# Altium schematic sheet toplevel.SchDoc
size A4
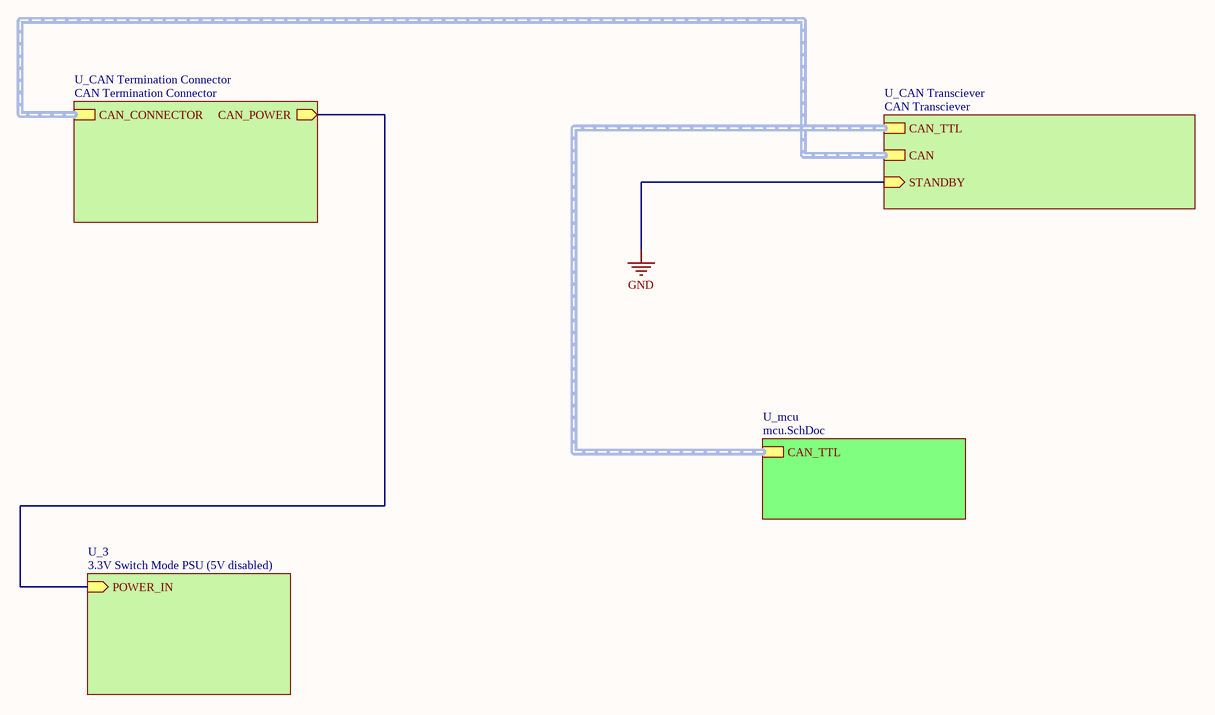
[diagram p0: toplevel.SchDoc]

## Sub-sheets
U_3 = 3.3V Switch Mode PSU (5V disabled): POWER_IN (in)
U_CAN Termination Connector = CAN Termination Connector: CAN_CONNECTOR (harness CAN), CAN_POWER (out)
U_CAN Transciever = CAN Transciever: CAN_TTL (harness CAN_TTL), CAN (harness CAN), STANDBY (in)
U_mcu = mcu.SchDoc: CAN_TTL (harness CAN_TTL)

## Nets
GND: sheet U_CAN Transciever/STANDBY
(unnamed): sheet U_CAN Termination Connector/CAN_POWER, sheet U_3/POWER_IN

## Buses and harness runs
harness sheet U_CAN Termination Connector/CAN_CONNECTOR = sheet U_CAN Transciever/CAN
harness sheet U_CAN Transciever/CAN_TTL = sheet U_mcu/CAN_TTL